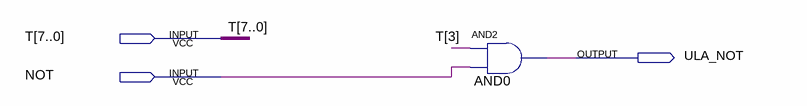
[diagram p0: schematic sheet]
// Quartus schematic ULA_NOT.bdf as structural Verilog: 1 symbols, 3 pins
module ULA_NOT (
  input  [7:0] T,
  input  NOT,
  output ULA_NOT
);

  and AND0 (ULA_NOT, T[3], NOT);
endmodule
